# EAGLE design two_tone_#1 (EAGLE 6.6.0)
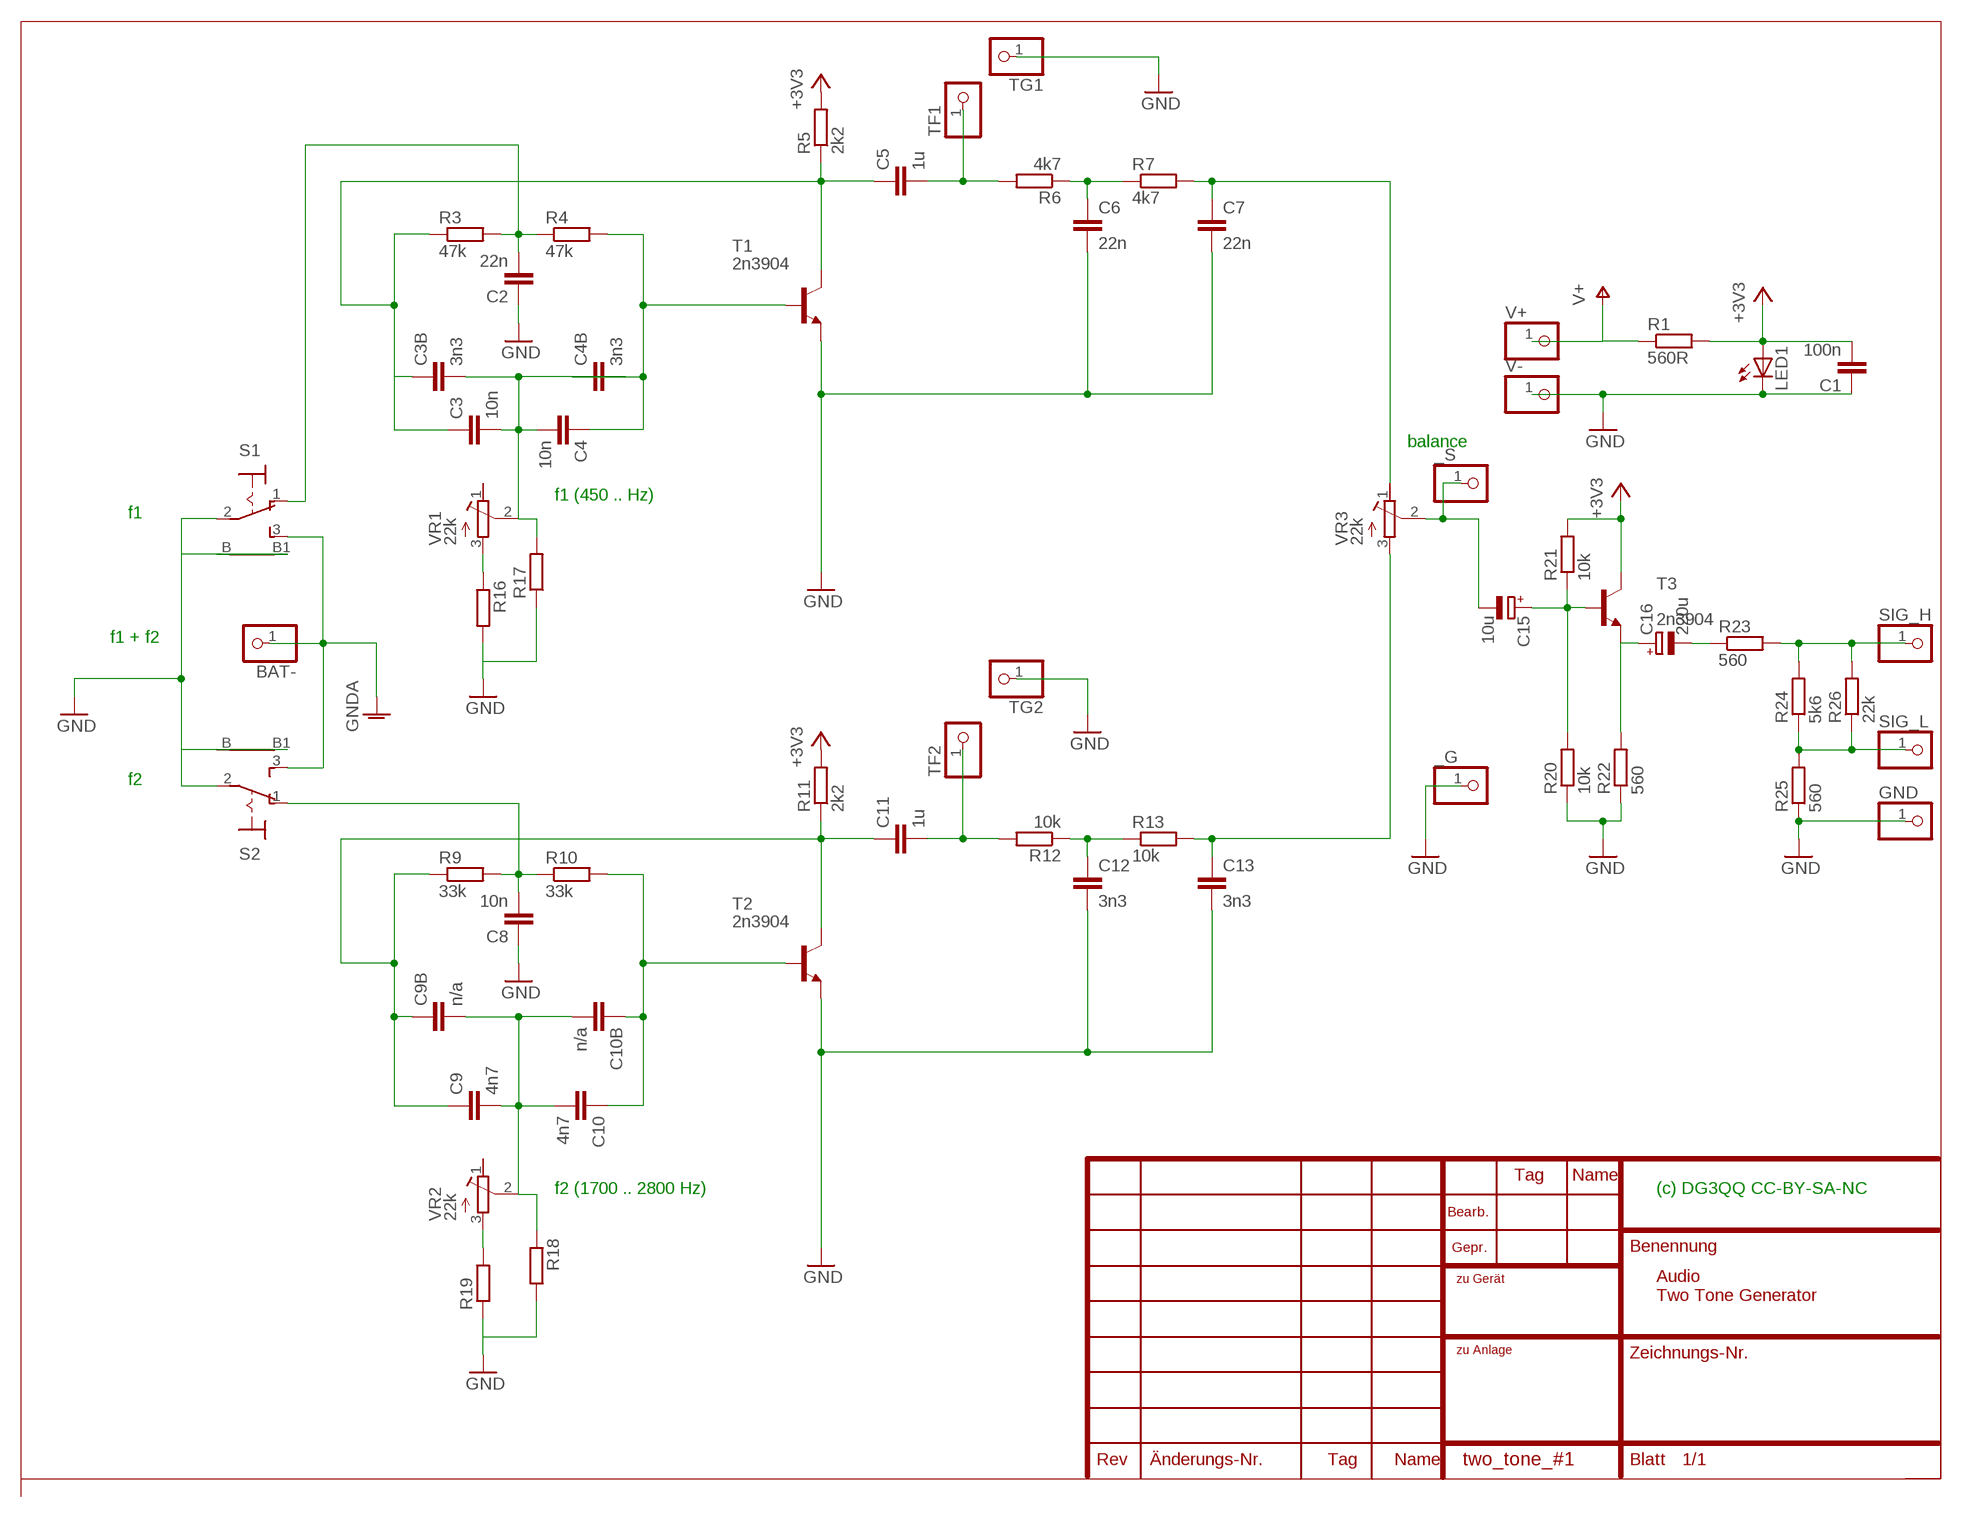
[diagram p0: schematic, sheet 1]

## Parts
_G  PINHD-1X1  [1X01]
_S  PINHD-1X1  [1X01]
BAT-  PINHD-1X1  [1X01]
C1  100n  C-EU025_050-025X075  [C025_050-025X075]
C2  22n  C-EU025_050-025X075  [C025_050-025X075]
C3  10n  C-EU025_050-025X075  [C025_050-025X075]
C3B  3n3  C-EU025_050-025X075  [C025_050-025X075]
C4  10n  C-EU025_050-025X075  [C025_050-025X075]
C4B  3n3  C-EU025_050-025X075  [C025_050-025X075]
C5  1u  C-EU025_050-025X075  [C025_050-025X075]
C6  22n  C-EU025_050-025X075  [C025_050-025X075]
C7  22n  C-EU025_050-025X075  [C025_050-025X075]
C8  10n  C-EU025_050-025X075  [C025_050-025X075]
C9  4n7  C-EU025_050-025X075  [C025_050-025X075]
C9B  n/a  C-EU025_050-025X075  [C025_050-025X075]
C10  4n7  C-EU025_050-025X075  [C025_050-025X075]
C10B  n/a  C-EU025_050-025X075  [C025_050-025X075]
C11  1u  C-EU025_050-025X075  [C025_050-025X075]
C12  3n3  C-EU025_050-025X075  [C025_050-025X075]
C13  3n3  C-EU025_050-025X075  [C025_050-025X075]
C15  10u  CPOL-EUE2.5-5  [E2,5-5]
C16  220u  CPOL-EUE5-10.5  [E5-10,5]
GND  PINHD-1X1  [1X01]
LED1  LED3MM  [LED3MM]
R1  560R  R-EU_0207/2V  [0207/2V]
R3  47k  R-EU_0207/10  [0207/10]
R4  47k  R-EU_0207/2V  [0207/2V]
R5  2k2  R-EU_0207/2V  [0207/2V]
R6  4k7  R-EU_0207/2V  [0207/2V]
R7  4k7  R-EU_0207/2V  [0207/2V]
R9  33k  R-EU_0207/10  [0207/10]
R10  33k  R-EU_0207/2V  [0207/2V]
R11  2k2  R-EU_0207/2V  [0207/2V]
R12  10k  R-EU_0207/2V  [0207/2V]
R13  10k  R-EU_0207/2V  [0207/2V]
R16  R-EU_0207/2V  [0207/2V]
R17  R-EU_0207/2V  [0207/2V]
R18  R-EU_0207/2V  [0207/2V]
R19  R-EU_0207/2V  [0207/2V]
R20  10k  R-EU_0207/2V  [0207/2V]
R21  10k  R-EU_0207/2V  [0207/2V]
R22  560  R-EU_0207/2V  [0207/2V]
R23  560  R-EU_0207/2V  [0207/2V]
R24  5k6  R-EU_0207/2V  [0207/2V]
R25  560  R-EU_0207/2V  [0207/2V]
R26  22k  R-EU_0207/2V  [0207/2V]
S1  9070-1W  [9070-1W]
S2  9070-1W  [9070-1W]
SIG_H  PINHD-1X1  [1X01]
SIG_L  PINHD-1X1  [1X01]
T1  2n3904  2N3904-NPN-TO92-EBC  [TO92-EBC]
T2  2n3904  2N3904-NPN-TO92-EBC  [TO92-EBC]
T3  2n3904  2N3904-NPN-TO92-EBC  [TO92-EBC]
TF1  PINHD-1X1  [1X01]
TF2  PINHD-1X1  [1X01]
TG1  PINHD-1X1  [1X01]
TG2  PINHD-1X1  [1X01]
V+  PINHD-1X1  [1X01]
V-  PINHD-1X1  [1X01]
VR1  22k  R-TRIMM_414S6  [SPINDLE_414S6]
VR2  22k  R-TRIMM_414S6  [SPINDLE_414S6]
VR3  22k  R-TRIMM_414S6  [SPINDLE_414S6]

## Nets
+3V3: C1.2 LED1.A R1.2 R5.2 R11.2 R21.2 T3.C
BAT-: BAT-.1 S1.3(S) S2.3(S) ; supply symbol labelled GNDA
GND: _G.1 C1.1 C2.1 C6.2 C7.2 C8.1 C12.2 C13.2 GND.1 LED1.K(C) R16.2 R17.1 R18.2 R19.1 R20.1 R22.1 R25.1 S1.2(P) S1.B S1.B1 S2.2(P) S2.B S2.B1 T1.E T2.E TG1.1 TG2.1 V-.1
N$1: C5.2 R6.2 TF1.1
N$2: C6.1 R6.1 R7.1
N$3: C2.2 R3.2 R4.1 S1.1(O)
N$4: C4.1 C4B.1 R4.2 T1.B
N$5: C3.1 C3B.1 C5.1 R3.1 R5.1 T1.C
N$6: C3.2 C3B.2 C4.2 C4B.2 R17.2 VR1.2(S)
N$7: C7.1 R7.2 VR3.1(A)
N$8: C8.2 R9.2 R10.1 S2.1(O)
N$9: C10.1 C10B.1 R10.2 T2.B
N$10: C9.1 C9B.1 C11.1 R9.1 R11.1 T2.C
N$11: C9.2 C9B.2 C10.2 C10B.2 R18.1 VR2.2(S)
N$12: C11.2 R12.2 TF2.1
N$13: C12.1 R12.1 R13.1
N$14: C13.1 R13.2 VR3.3(E)
N$15: R19.2 VR2.3(E)
N$16: C15.+ R20.2 R21.1 T3.B
N$17: _S.1 C15.- VR3.2(S)
N$19: R16.1 VR1.3(E)
N$20: C16.+ R22.2 T3.E
N$23: C16.- R23.1
N$24: R23.2 R24.2 R26.2 SIG_H.1
N$25: R24.1 R25.2 R26.1 SIG_L.1
V+: R1.1 V+.1
Unconnected: VR1.1(A) VR2.1(A)

## Notes on the sheet
- balance
- f1 (450 .. Hz)
- f1
- f1 + f2
- f2
- f2 (1700 .. 2800 Hz) | (c) DG3QQ CC-BY-SA-NC
- Audio 
  Two Tone Generator

## Library data of the parts
_G _S BAT- GND SIG_H SIG_L TF1 TF2 TG1 TG2 V+ V- = pinhead:PINHD-1X1: PIN HEADER
C1-C3 C3B C4 C4B C5-C9 C9B C10 C10B C11-C13 = resistor:C-EU: CAPACITOR, European symbol
C15 C16 = resistor:CPOL-EU: POLARIZED CAPACITOR, European symbol
LED1 = led:LED: LED OSRAM: - CHIPLED LG R971, LG N971, LY N971, LG Q971, LY Q971, LO R971, LY R971 LH N974, LH R974 LS Q976, LO Q976, LY Q976 LO Q996 - Hyper CHIPLED LW Q18S LB Q993, LB Q99A, LB R99A - SideLED LS A670, LO A670, LY A670, LG A670, LP A670 LB A673, LV A673, LT A673, LW A673 LH A674 LY A675 LS A676, LA A676, LO A676, LY A676, LW A676 LS A679, LY A679, LG A679 - Hyper Micro SIDELED® LS Y876, LA Y876, LO Y876, LY Y876 LT Y87S - SmartLED LW L88C, LW L88S LB L89C, LB L89S, LG L890 LS L89K, LO L89K, LY L89K LS L896, LA L896, LO L896, LY L896 - TOPLED LS T670, LO T670, LY T670, LG T670, LP T670 LSG T670, LSP T670, LSY T670, LOP T670, LYG T670 LG T671, LOG T671, LSG T671 LB T673, LV T673, LT T673, LW T673 LH T674 LS T676, LA T676, LO T676, LY T676, LB T676, LH T676, LSB T676, LW T676 LB T67C, LV T67C, LT T67C, LS T67K, LO T67K, LY T67K, LW E67C LS E67B, LA E67B, LO E67B, LY E67B, LB E67C, LV E67C, LT E67C LW T67C LS T679, LY T679, LG T679 LS T770, LO T770, LY T770, LG T770, LP T770 LB T773, LV T773, LT T773, LW T773 LH T774 LS E675, LA E675, LY E675, LS T675 LS T776, LA T776, LO T776, LY T776, LB T776 LHGB T686 LT T68C, LB T68C - Hyper Mini TOPLED® LB M676 - Mini TOPLED Santana® LG M470 LS M47K, LO M47K, LY M47K Source: http://www.osram.convergy.de LUXEON: - LUMILED® LXK2-PW12-R00, LXK2-PW12-S00, LXK2-PW14-U00, LXK2-PW14-V00 LXK2-PM12-R00, LXK2-PM12-S00, LXK2-PM14-U00 LXK2-PE12-Q00, LXK2-PE12-R00, LXK2-PE12-S00, LXK2-PE14-T00, LXK2-PE14-U00 LXK2-PB12-K00, LXK2-PB12-L00, LXK2-PB12-M00, LXK2-PB14-N00, LXK2-PB14-P00, LXK2-PB14-Q00 LXK2-PR12-L00, LXK2-PR12-M00, LXK2-PR14-Q00, LXK2-PR14-R00 LXK2-PD12-Q00, LXK2-PD12-R00, LXK2-PD12-S00 LXK2-PH12-R00, LXK2-PH12-S00 LXK2-PL12-P00, LXK2-PL12-Q00, LXK2-PL12-R00 Source: www.luxeon.com KINGBRIGHT: KA-3528ASYC Source: www.kingbright.com
R1 R3-R7 R9-R13 R16-R26 = resistor:R-EU_: RESISTOR, European symbol
S1 S2 = switch:9070-1W: TOGGLE SWITCH Marquardt
T1-T3 = transistor-neu-to92:*-NPN-: NPN Transistror
VR1-VR3 = dg3qq_:R-TRIMM_414S6

## Board
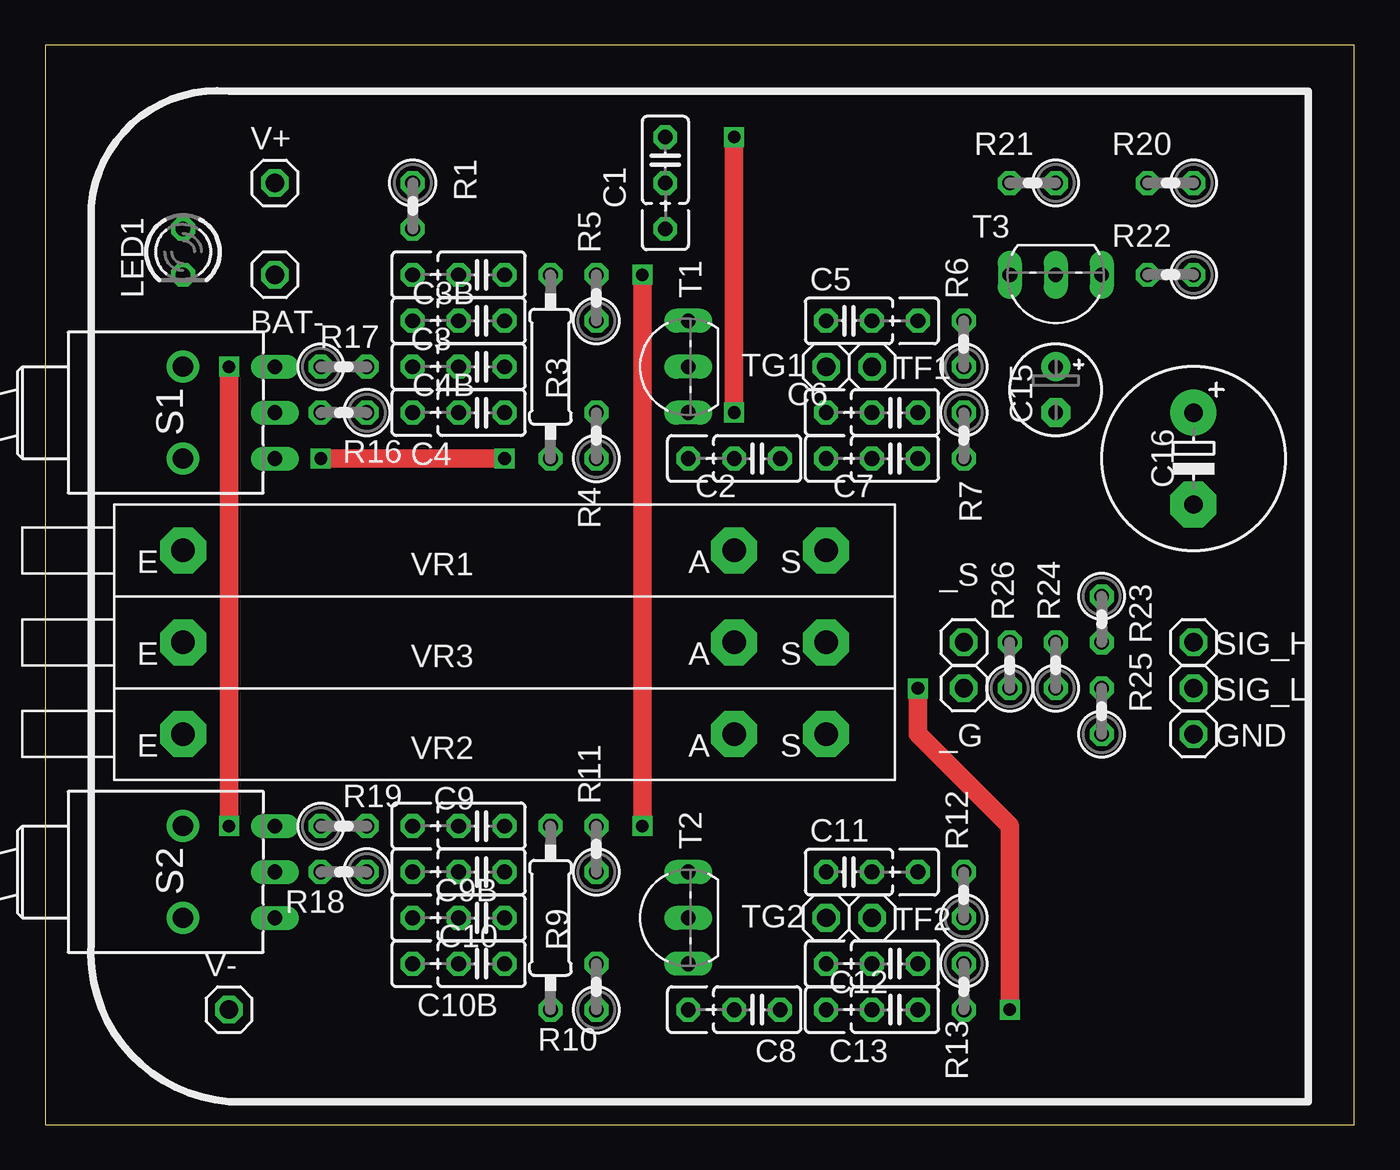
[diagram p1: board, top side]
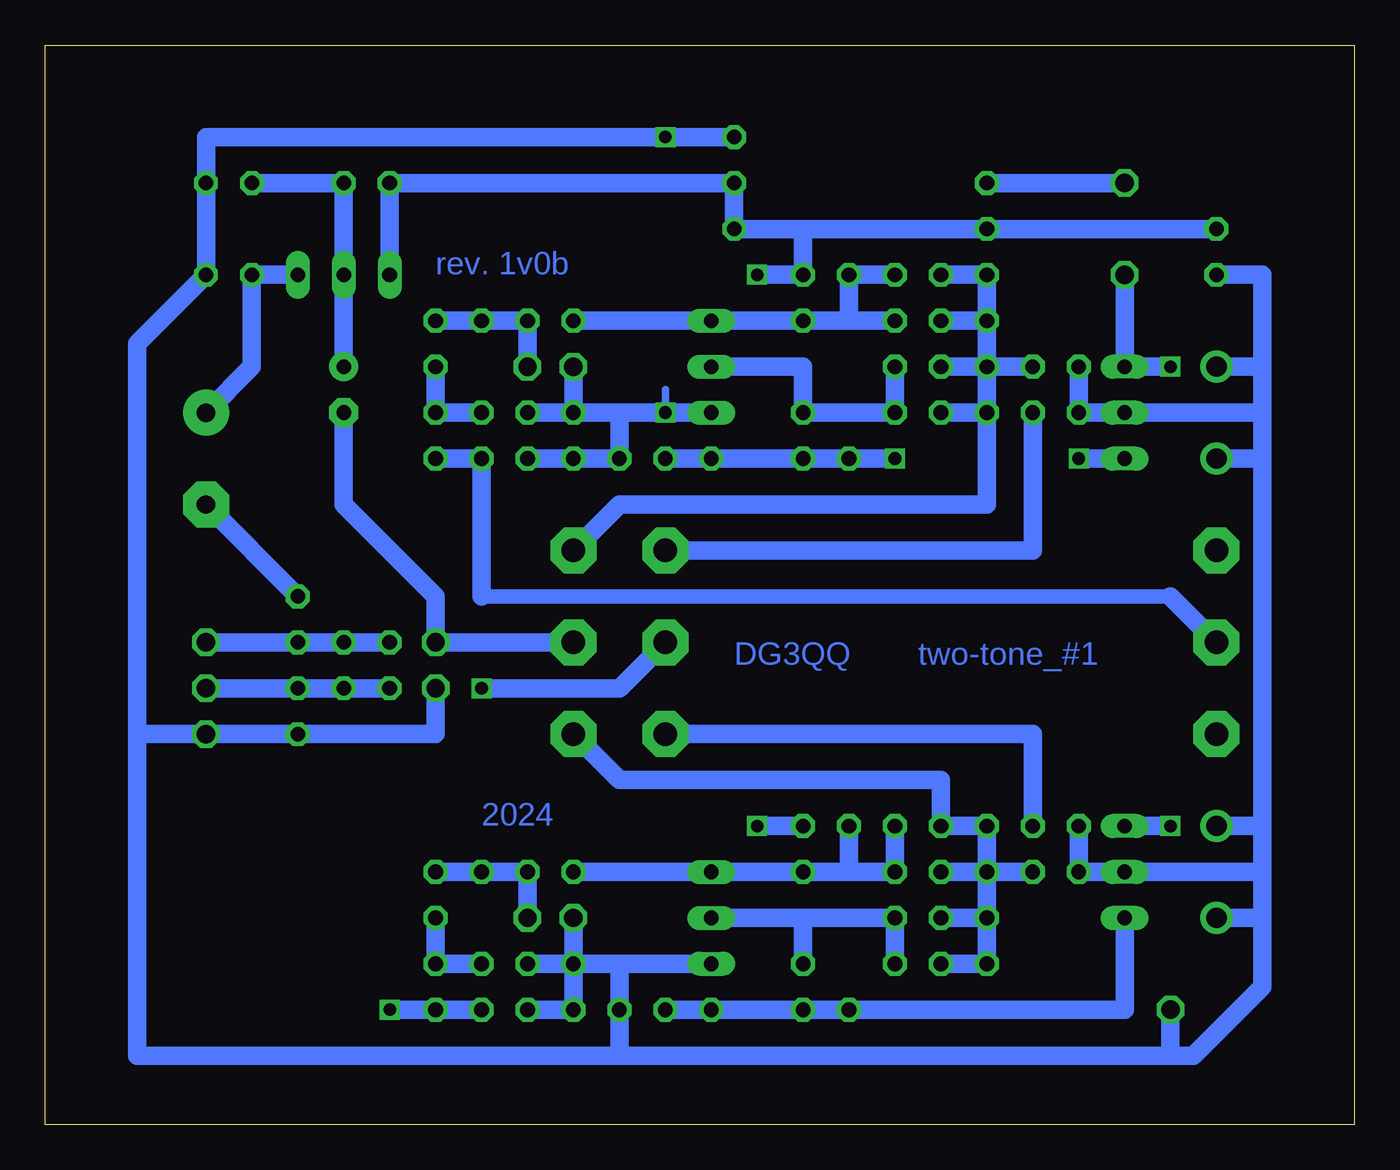
[diagram p2: board, bottom side, seen from below]

Size 72.39 x 59.69 mm. Coordinates in mm from the lower left corner, seen from the top.
Outline: 0,0 72.39,0 72.39,59.69 0,59.69 0,0
Copper layers (1*16): Top 0.035mm / dielectric 1.5mm / Bottom 0.035mm
Design rules "default": minimum track width 10mil, minimum drill 24mil, track to track 8mil, track to pad 8mil, pad to pad 8mil, via to via 8mil, smd to smd 8mil, copper to edge 40mil, drill to drill 8mil, minimum pad ring 10mil, minimum via ring 8mil, stop-mask expansion 4mil, vias tented up to drill 0mil, thermal gap 10mil

### Footprints (pad centres in the part's own frame; a part is rotated, then mirrored left to right if it is on the bottom)
1X01 = drill 1.016 octagon: 1 0,0
C025_050-025X075 = drill 0.813 octagon: 1 -1.27,0; 2 1.27,0; 3 3.81,0
E2,5-5 = drill 0.813 pad 1.6: + -1.27,0 | drill 0.813 pad 1.6 octagon: - 1.27,0
E5-10,5 = drill 1.016 pad 2.54: + -2.54,0 | drill 1.016 pad 2.54 octagon: - 2.54,0
LED3MM = drill 0.813 octagon: A -1.27,0; K 1.27,0
0207/2V = drill 0.813 octagon: 1 -1.27,0; 2 1.27,0
0207/10 = drill 0.813 octagon: 1 -5.08,0; 2 5.08,0
9070-1W = drill 0.813 long: 1 5.08,-2.54; 2 5.08,0; 3 5.08,2.54 | drill 1.118 pad 1.778: B 0,-2.54; B1 0,2.54
TO92-EBC = drill 0.813 long: B 0,-1.27; C 2.54,-1.27; E -2.54,-1.27
SPINDLE_414S6 = drill 1.3 pad 2.54 octagon: 1 -2.54,0; 2 33.02,0; 3 27.94,0

### Placement (x,y rotation side)
_G  50.8,24.13 0 top
_S  50.8,26.67 0 top
BAT-  12.7,46.99 0 top
C1  34.29,53.34 270 top
C2  39.37,36.83 180 top
C3  24.13,44.45 180 top
C3B  24.13,46.99 180 top
C4  24.13,39.37 180 top
C4B  24.13,41.91 180 top
C5  44.45,44.45 0 top
C6  46.99,39.37 180 top
C7  46.99,36.83 180 top
C8  39.37,6.35 180 top
C9  24.13,16.51 180 top
C9B  24.13,13.97 180 top
C10  24.13,11.43 180 top
C10B  24.13,8.89 180 top
C11  44.45,13.97 0 top
C12  46.99,8.89 180 top
C13  46.99,6.35 180 top
C15  55.88,40.64 270 top
C16  63.5,36.83 270 top
GND  63.5,21.59 0 top
LED1  7.62,48.26 270 top
R1  20.32,50.8 270 top
R3  27.94,41.91 270 top
R4  30.48,38.1 90 top
R5  30.48,45.72 90 top
R6  50.8,43.18 90 top
R7  50.8,38.1 270 top
R9  27.94,11.43 270 top
R10  30.48,7.62 90 top
R11  30.48,15.24 90 top
R12  50.8,12.7 90 top
R13  50.8,7.62 270 top
R16  16.51,39.37 180 top
R17  16.51,41.91 0 top
R18  16.51,13.97 180 top
R19  16.51,16.51 0 top
R20  62.23,52.07 180 top
R21  54.61,52.07 180 top
R22  62.23,46.99 180 top
R23  58.42,27.94 270 top
R24  55.88,25.4 90 top
R25  58.42,22.86 90 top
R26  53.34,25.4 90 top
S1  7.62,39.37 0 top
S2  7.62,13.97 0 top
SIG_H  63.5,26.67 0 top
SIG_L  63.5,24.13 0 top
T1  34.29,41.91 90 top
T2  34.29,11.43 90 top
T3  55.88,45.72 180 top
TF1  45.72,41.91 0 top
TF2  45.72,11.43 0 top
TG1  43.18,41.91 0 top
TG2  43.18,11.43 0 top
V+  12.7,52.07 0 top
V-  10.16,6.35 0 top
VR1  10.16,31.75 0 top
VR2  10.16,21.59 0 top
VR3  10.16,26.67 0 top

### Tracks (layer width: path | path; a pad name or v marks a point on that pad's centre or on a via)
+3V3  (via drill 0.7)
  Top 1.016: v33.02,46.99 v33.02,16.51
  Bottom 1.016: LED1.A R1.2 30.48,49.53 | T3.C R21.2 C1.2 34.29,49.53 30.48,49.53 | 30.48,49.53 R5.2 v33.02,46.99 | v33.02,16.51 R11.2
BAT-  (via drill 0.7)
  Top 1.016: v10.16,41.91 v10.16,16.51
  Bottom 1.016: BAT-.1 S1.3 v10.16,41.91 | v10.16,16.51 S2.3
GND  (via drill 0.7)
  Top 1.016: v38.1,54.61 v38.1,39.37
  Bottom 0.406: v38.1,39.37 38.1,40.64 | 6.35,41.91 S1.B1
  Bottom 1.016: T1.E v38.1,39.37 40.64,39.37 | C6.2 43.18,39.37 | 40.64,3.81 67.31,3.81 67.31,21.59 | 40.64,3.81 C8.1 40.64,8.89 | 10.16,3.81 8.89,3.81 5.08,7.62 5.08,11.43 | 10.16,3.81 40.64,3.81 | 5.08,36.83 5.08,16.51 | S1.B 5.08,36.83 | 5.08,36.83 5.08,39.37 | 5.08,39.37 5.08,41.91 | 5.08,41.91 S1.B1 | 40.64,39.37 C2.1 C7.2 | C1.1 v38.1,54.61 63.5,54.61 R20.1 R22.1 67.31,43.18 67.31,21.59 | 5.08,41.91 5.08,46.99 LED1.K | 5.08,13.97 5.08,11.43 | 5.08,11.43 S2.B | 5.08,39.37 S1.2 R16.2 R17.1 | S2.B1 5.08,16.51 | 5.08,16.51 5.08,13.97 | 5.08,13.97 R18.2 | R18.2 R19.1 | R18.2 S2.2 | 67.31,21.59 GND.1 R25.1 50.8,21.59 _G.1 | 40.64,39.37 43.18,39.37 | 43.18,39.37 TG1.1 | V-.1 10.16,3.81 | 43.18,8.89 43.18,6.35 C13.2 | 40.64,8.89 43.18,8.89 | 43.18,8.89 TG2.1 | T2.E 40.64,8.89 | 43.18,8.89 C12.2
N$1
  Bottom 1.016: R6.2 C5.2 TF1.1
N$2
  Bottom 1.016: R6.1 R7.1 C6.1
N$3  (via drill 0.7)
  Top 1.016: v25.4,36.83 v15.24,36.83
  Bottom 1.016: C2.2 R4.1 R3.2 v25.4,36.83 | S1.1 v15.24,36.83
N$4
  Bottom 1.016: T1.B 30.48,41.91 R4.2 C4.1 C4B.1
N$5
  Bottom 1.016: C3.1 27.94,44.45 | 27.94,44.45 R5.1 T1.C C5.1 | C3B.1 R3.1 27.94,44.45
N$6
  Bottom 1.016: C4B.2 20.32,41.91 | 20.32,41.91 20.32,39.37 | C4.2 20.32,39.37 | 20.32,39.37 20.32,34.29 40.64,34.29 VR1.2 | R17.2 20.32,41.91 | 20.32,44.45 20.32,41.91 | C3B.2 20.32,46.99 20.32,44.45 | 20.32,44.45 C3.2
N$7
  Bottom 0.813: 48.26,29.21 10.16,29.21
  Bottom 1.016: 48.26,29.21 C7.1 R7.2 | 10.16,29.21 VR3.1
N$8
  Bottom 1.016: C8.2 R10.1 R9.2 12.7,6.35 S2.1
N$9
  Bottom 1.016: T2.B 30.48,11.43 | R10.2 30.48,11.43 | 30.48,11.43 C10.1 C10B.1
N$10
  Bottom 1.016: 27.94,13.97 C9B.1 C9.1 | 27.94,13.97 R11.1 T2.C C11.1 | 27.94,13.97 R9.1
N$11
  Bottom 1.016: 20.32,13.97 20.32,16.51 C9.2 22.86,19.05 40.64,19.05 VR2.2 | 20.32,11.43 20.32,13.97 | 20.32,13.97 C9B.2 R18.1 | C10.2 20.32,11.43 | 20.32,11.43 20.32,8.89 C10B.2
N$12
  Bottom 1.016: TF2.1 C11.2 R12.2
N$13
  Bottom 1.016: R12.1 R13.1 C12.1
N$14  (via drill 0.7)
  Top 1.016: v53.34,6.35 53.34,16.51 48.26,21.59 v48.26,24.13
  Bottom 1.016: R13.2 C13.1 v53.34,6.35 | v48.26,24.13 40.64,24.13 VR3.3
N$15
  Bottom 1.016: VR2.3 17.78,21.59 R19.2
N$16
  Bottom 1.016: R20.2 R21.1 T3.B C15.+
N$17
  Bottom 1.016: VR3.2 _S.1 50.8,29.21 55.88,34.29 C15.-
N$19
  Bottom 1.016: VR1.3 17.78,31.75 R16.1
N$20
  Bottom 1.016: T3.E R22.2 60.96,41.91 C16.+
N$23
  Bottom 1.016: R23.1 C16.-
N$24
  Bottom 1.016: SIG_H.1 R23.2 R24.2 R26.2
N$25
  Bottom 1.016: SIG_L.1 R25.2 R24.1 R26.1
V+
  Bottom 1.016: V+.1 R1.1

### Text on the board
Bottom: rev. 1v0b | two-tone_#1 | DG3QQ | 2024